# Altium schematic sheet LEDs.SchDoc
size A4
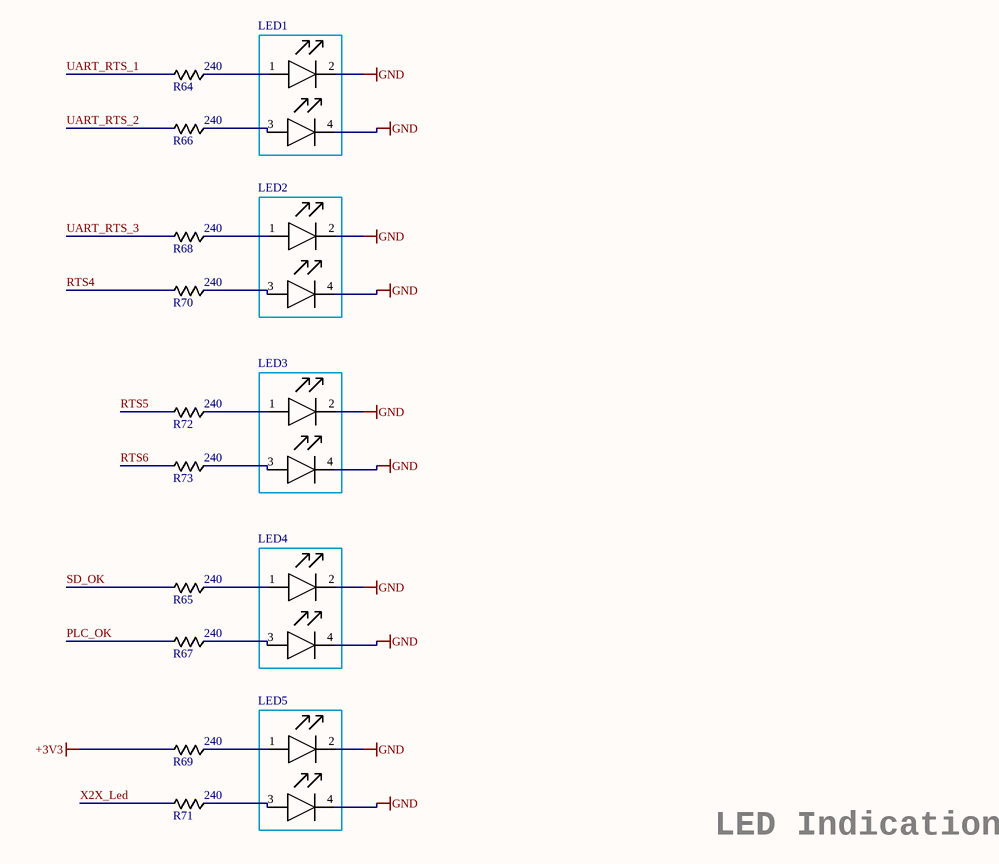
[diagram p0: LEDs.SchDoc]

## Parts
LED1  Light Guide 2  [LED SMD DayLight]  (value not drawn)
LED2  Light Guide 2  [LED SMD DayLight]  (value not drawn)
LED3  Light Guide 2  [LED SMD DayLight]  (value not drawn)
LED4  Light Guide 2  [LED SMD DayLight]  (value not drawn)
LED5  Light Guide 2  [LED SMD DayLight]  (value not drawn)
R64  240  [0603 - RES]
R65  240  [0603 - RES]
R66  240  [0603 - RES]
R67  240  [0603 - RES]
R68  240  [0603 - RES]
R69  240  [0603 - RES]
R70  240  [0603 - RES]
R71  240  [0603 - RES]
R72  240  [0603 - RES]
R73  240  [0603 - RES]

## Nets
+3V3: R69.2
GND: LED1.2 LED1.4 LED2.2 LED2.4 LED3.2 LED3.4 LED4.2 LED4.4 LED5.2 LED5.4
PLC_OK: R67.2
RTS4: R70.2
RTS5: R72.2
RTS6: R73.2
SD_OK: R65.2
UART_RTS_1: R64.2
UART_RTS_2: R66.2
UART_RTS_3: R68.2
X2X_Led: R71.2
NetLED1_1: LED1.1 R64.1
NetLED1_3: LED1.3 R66.1
NetLED2_1: LED2.1 R68.1
NetLED2_3: LED2.3 R70.1
NetLED3_1: LED3.1 R72.1
NetLED3_3: LED3.3 R73.1
NetLED4_1: LED4.1 R65.1
NetLED4_3: LED4.3 R67.1
NetLED5_1: LED5.1 R69.1
NetLED5_3: LED5.3 R71.1

## Notes on the sheet
- LED Indication

## Library data of the parts
LED1-LED3 = Light Guide 2: KP-1608SYC
LED4 LED5 = Light Guide 2: KP-1608SGC
R64-R73 = Resistor 0805: 0805 SMD Resistor